# Altium project V_6.PrjPcb
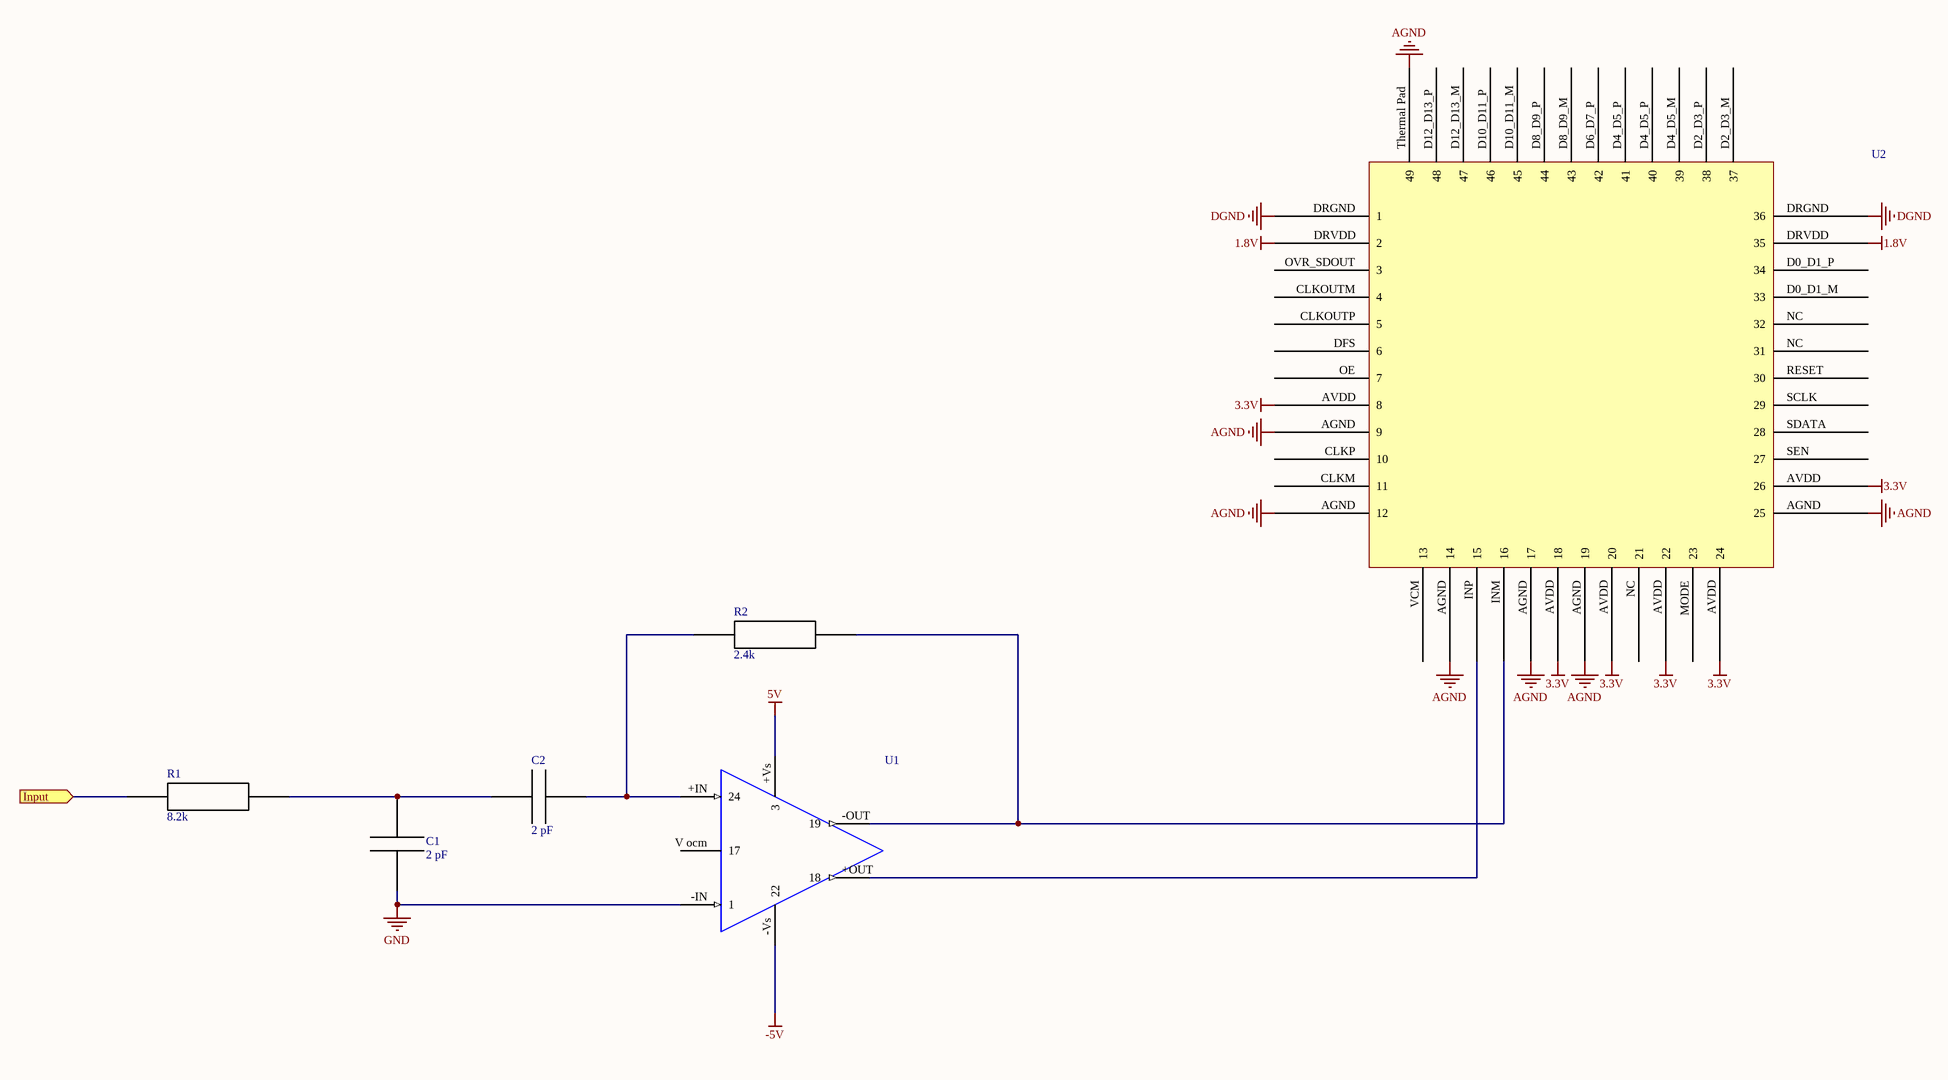
[diagram p0: V_6.SchDoc]
1 sheet, 6 parts. Net scope: flat (ports and power ports of the same name join across sheets).
Board file: V_6.PcbDoc

## Sheet V_6.SchDoc
size A1

### Parts
C1  2 pF  [C_0805]
C2  2 pF  [C_0805]
R1  8.2k
R2  2.4k
U1  (no value)  [ADA4932-2]
U2  (no value)  [ADS61B49]

### Ports
Input (in)

### Nets
1.8V: U2.DRVDD(35)
3.3V: U2.AVDD(8)
5V: U1.+Vs(3)
-5V: U1.-Vs(22)
AGND: U2.AGND(9) U2.Thermal_Pad(49)
DGND: U2.DRGND(36)
GND: C1.1 U1.-IN(1)
NetC1_2: C1.2 C2.1 R1.2
NetC2_2: C2.2 R2.1 U1.+IN(24)
NetR1_1: R1.1 ; port Input
NetR2_2: R2.2 U1.-OUT(19) U2.INM(16)
NetU1_+OUT: U1.+OUT(18) U2.INP(15)

Not connected (* = marked no-connect by the designer): U1 V ocm(17); U2 CLKM(11) CLKOUTM(4) CLKOUTP(5) CLKP(10) D0_D1_M(33) D0_D1_P(34) D2_D3_M(37) D2_D3_P(38) D4_D5_M(39) D4_D5_P(40) D6_D7_P(42) D8_D9_M(43) D8_D9_P(44) D10_D11_M(45) D10_D11_P(46) D12_D13_M(47) D12_D13_P(48) DFS(6) MODE(23) NC(31) OE(7) OVR_SDOUT(3) RESET(30) SCLK(29) SDATA(28) SEN(27) VCM(13)

### Library data of the parts
C1 C2 = C
R1 R2 = R
U1 = ADA4932-2
U2 = ADS61B49